# EAGLE design General IO (EAGLE 5.03)
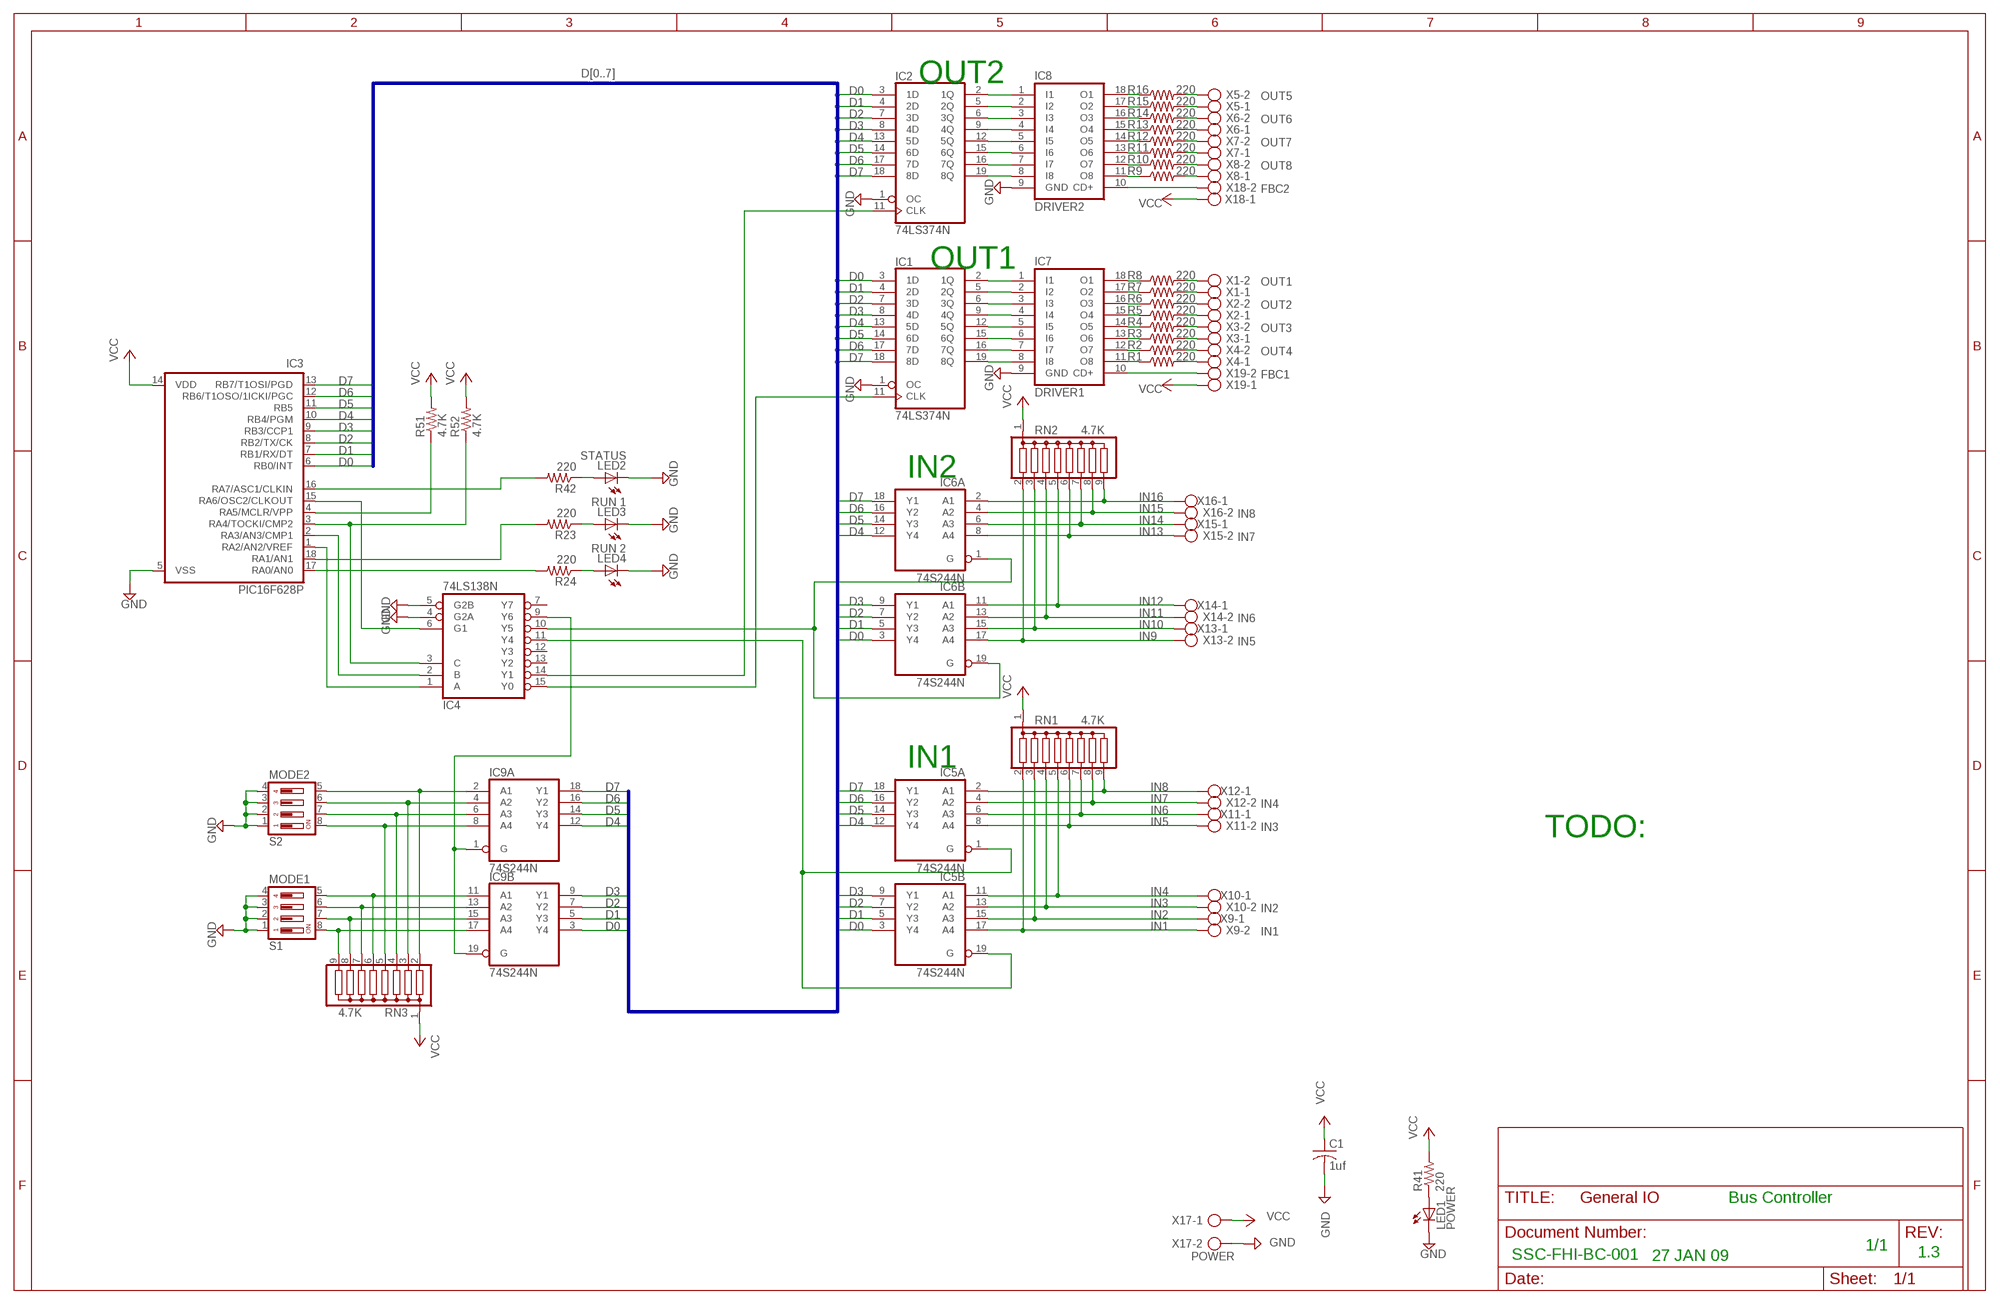
[diagram p0: schematic, sheet 1]

## Parts
C1  1uf  C-US025-025X050  [C025-025X050]
IC1  74LS374N  [DIL20]
IC2  74LS374N  [DIL20]
IC3  PIC16F628P  [DIL18]
IC4  74LS138N  [DIL16]
IC5  74S244N  [DIL20]
IC6  74S244N  [DIL20]
IC7  DRIVER1  ULN2803A  [DIL18]
IC8  DRIVER2  ULN2803A  [DIL18]
IC9  74S244N  [DIL20]
LED1  POWER  LED5MM  [LED5MM]
LED2  STATUS  LED5MM  [LED5MM]
LED3  RUN 1  LED5MM  [LED5MM]
LED4  RUN 2  LED5MM  [LED5MM]
R1  220  R-US_0207/2V  [0207/2V]
R2  220  R-US_0207/2V  [0207/2V]
R3  220  R-US_0207/2V  [0207/2V]
R4  220  R-US_0207/2V  [0207/2V]
R5  220  R-US_0207/2V  [0207/2V]
R6  220  R-US_0207/2V  [0207/2V]
R7  220  R-US_0207/2V  [0207/2V]
R8  220  R-US_0207/2V  [0207/2V]
R9  220  R-US_0207/2V  [0207/2V]
R10  220  R-US_0207/2V  [0207/2V]
R11  220  R-US_0207/2V  [0207/2V]
R12  220  R-US_0207/2V  [0207/2V]
R13  220  R-US_0207/2V  [0207/2V]
R14  220  R-US_0207/2V  [0207/2V]
R15  220  R-US_0207/2V  [0207/2V]
R16  220  R-US_0207/2V  [0207/2V]
R23  220  R-US_0207/2V  [0207/2V]
R24  220  R-US_0207/2V  [0207/2V]
R41  220  R-US_0207/2V  [0207/2V]
R42  220  R-US_0207/2V  [0207/2V]
R51  4.7K  R-US_0207/2V  [0207/2V]
R52  4.7K  R-US_0207/2V  [0207/2V]
RN1  4.7K  G08R  [SIL9]
RN2  4.7K  G08R  [SIL9]
RN3  4.7K  G08R  [SIL9]
S1  MODE1  DS04  [DS-04]
S2  MODE2  DS04  [DS-04]
X1  OUT1  AK550/2  [AK550/2]
X2  OUT2  AK550/2  [AK550/2]
X3  OUT3  AK550/2  [AK550/2]
X4  OUT4  AK550/2  [AK550/2]
X5  OUT5  AK550/2  [AK550/2]
X6  OUT6  AK550/2  [AK550/2]
X7  OUT7  AK550/2  [AK550/2]
X8  OUT8  AK550/2  [AK550/2]
X9  IN1  AK550/2  [AK550/2]
X10  IN2  AK550/2  [AK550/2]
X11  IN3  AK550/2  [AK550/2]
X12  IN4  AK550/2  [AK550/2]
X13  IN5  AK550/2  [AK550/2]
X14  IN6  AK550/2  [AK550/2]
X15  IN7  AK550/2  [AK550/2]
X16  IN8  AK550/2  [AK550/2]
X17  POWER  AK500/2  [AK500/2]
X18  FBC2  AK550/2  [AK550/2]
X19  FBC1  AK550/2  [AK550/2]

## Nets
A0: IC3.1(RA2/AN2/VREF) IC4.1(A)
A1: IC3.2(RA3/AN3/CMP1) IC4.2(B)
A2: IC3.3(RA4/TOCKI/CMP2) IC4.3(C) R52.1
ADDR_EN: IC3.15(RA6/OSC2/CLKOUT) IC4.6(G1)
D0: IC1.3(1D) IC2.3(1D) IC3.6(RB0/INT) IC5.3(B:Y4) IC6.3(B:Y4) IC9.3(B:Y4)
D1: IC1.4(2D) IC2.4(2D) IC3.7(RB1/RX/DT) IC5.5(B:Y3) IC6.5(B:Y3) IC9.5(B:Y3)
D2: IC1.7(3D) IC2.7(3D) IC3.8(RB2/TX/CK) IC5.7(B:Y2) IC6.7(B:Y2) IC9.7(B:Y2)
D3: IC1.8(4D) IC2.8(4D) IC3.9(RB3/CCP1) IC5.9(B:Y1) IC6.9(B:Y1) IC9.9(B:Y1)
D4: IC1.13(5D) IC2.13(5D) IC3.10(RB4/PGM) IC5.12(A:Y4) IC6.12(A:Y4) IC9.12(A:Y4)
D5: IC1.14(6D) IC2.14(6D) IC3.11(RB5) IC5.14(A:Y3) IC6.14(A:Y3) IC9.14(A:Y3)
D6: IC1.17(7D) IC2.17(7D) IC3.12(RB6/T1OSO/1ICKI/PGC) IC5.16(A:Y2) IC6.16(A:Y2) IC9.16(A:Y2)
D7: IC1.18(8D) IC2.18(8D) IC3.13(RB7/T1OSI/PGD) IC5.18(A:Y1) IC6.18(A:Y1) IC9.18(A:Y1)
FBC1: IC7.10(CD+) X19.2
FBC2: IC8.10(CD+) X18.2
GND: C1.2 IC1.1(OC) IC2.1(OC) IC3.5(VSS) IC4.4(G2A) IC4.5(G2B) IC7.9(GND) IC8.9(GND) LED1.K(C) LED2.K(C) LED3.K(C) LED4.K(C) S1.1 S1.2 S1.3 S1.4 S2.1 S2.2 S2.3 S2.4 X17.2
IN1: IC5.17(B:A4) RN1.2 X9.2
IN2: IC5.15(B:A3) RN1.3 X9.1
IN3: IC5.13(B:A2) RN1.4 X10.2
IN4: IC5.11(B:A1) RN1.5 X10.1
IN5: IC5.8(A:A4) RN1.6 X11.2
IN6: IC5.6(A:A3) RN1.7 X11.1
IN7: IC5.4(A:A2) RN1.8 X12.2
IN8: IC5.2(A:A1) RN1.9 X12.1
IN9: IC6.17(B:A4) RN2.2 X13.2
IN10: IC6.15(B:A3) RN2.3 X13.1
IN11: IC6.13(B:A2) RN2.4 X14.2
IN12: IC6.11(B:A1) RN2.5 X14.1
IN13: IC6.8(A:A4) RN2.6 X15.2
IN14: IC6.6(A:A3) RN2.7 X15.1
IN15: IC6.4(A:A2) RN2.8 X16.2
IN16: IC6.2(A:A1) RN2.9 X16.1
N$1: IC4.11(Y4) IC5.1(A:G) IC5.19(B:G)
N$2: IC3.4(RA5/MCLR/VPP) R51.1
N$4: IC7.12(O7) R2.1
N$5: IC2.11(CLK) IC4.14(Y1)
N$6: IC1.11(CLK) IC4.15(Y0)
N$10: IC9.2(A:A1) RN3.2 S2.5
N$11: IC9.4(A:A2) RN3.3 S2.6
N$12: IC7.18(O1) R8.1
N$13: IC7.17(O2) R7.1
N$14: IC7.16(O3) R6.1
N$15: IC7.15(O4) R5.1
N$16: IC9.6(A:A3) RN3.4 S2.7
N$17: IC8.12(O7) R10.1
N$18: IC4.10(Y5) IC6.1(A:G) IC6.19(B:G)
N$19: IC9.8(A:A4) RN3.5 S2.8
N$20: IC1.16(7Q) IC7.7(I7)
N$21: IC7.14(O5) R4.1
N$22: IC1.19(8Q) IC7.8(I8)
N$23: IC1.2(1Q) IC7.1(I1)
N$24: IC1.5(2Q) IC7.2(I2)
N$25: IC1.6(3Q) IC7.3(I3)
N$26: IC1.9(4Q) IC7.4(I4)
N$27: IC1.12(5Q) IC7.5(I5)
N$28: IC1.15(6Q) IC7.6(I6)
N$29: IC2.19(8Q) IC8.8(I8)
N$30: IC7.13(O6) R3.1
N$31: IC2.16(7Q) IC8.7(I7)
N$32: IC7.11(O8) R1.1
N$33: IC2.15(6Q) IC8.6(I6)
N$34: IC9.11(B:A1) RN3.6 S1.5
N$35: IC9.13(B:A2) RN3.7 S1.6
N$36: IC9.15(B:A3) RN3.8 S1.7
N$37: LED4.A R24.1
N$38: LED3.A R23.1
N$39: IC9.17(B:A4) RN3.9 S1.8
N$41: IC4.9(Y6) IC9.1(A:G) IC9.19(B:G)
N$55: IC2.2(1Q) IC8.1(I1)
N$56: IC2.5(2Q) IC8.2(I2)
N$57: IC2.6(3Q) IC8.3(I3)
N$58: IC2.9(4Q) IC8.4(I4)
N$59: IC2.12(5Q) IC8.5(I5)
N$61: IC8.18(O1) R16.1
N$62: IC8.17(O2) R15.1
N$63: IC8.16(O3) R14.1
N$64: IC8.15(O4) R13.1
N$65: IC8.14(O5) R12.1
N$66: IC8.13(O6) R11.1
N$68: IC8.11(O8) R9.1
N$71: LED1.A R41.1
N$106: LED2.A R42.1
OUT1: R8.2 X1.2
OUT2: R7.2 X1.1
OUT3: R6.2 X2.2
OUT4: R5.2 X2.1
OUT5: R4.2 X3.2
OUT6: R3.2 X3.1
OUT7: R2.2 X4.2
OUT8: R1.2 X4.1
OUT9: R16.2 X5.2
OUT10: R15.2 X5.1
OUT11: R14.2 X6.2
OUT12: R13.2 X6.1
OUT13: R12.2 X7.2
OUT14: R11.2 X7.1
OUT15: R10.2 X8.2
OUT16: R9.2 X8.1
RUN1: IC3.18(RA1/AN1) R23.2
RUN2: IC3.17(RA0/AN0) R24.2
STATUS: IC3.16(RA7/ASC1/CLKIN) R42.2
VCC: C1.1 IC3.14(VDD) R41.2 R51.2 R52.2 RN1.1 RN2.1 RN3.1 X17.1 X18.1 X19.1
Unconnected: IC4.7(Y7) IC4.12(Y3) IC4.13(Y2)

## Buses
D[0..7]

## Notes on the sheet
- OUT2
- OUT1
- IN2
- IN1
- TODO:
- Bus Controller
- 1/1
- SSC-FHI-BC-001 | 27 JAN 09 | 1.3

## Power pins joined to a net without a drawn wire
GND: IC1.10(GND) IC2.10(GND) IC4.8(GND) IC5.10(P:GND) IC6.10(P:GND) IC9.10(P:GND)
VCC: IC1.20(VCC) IC2.20(VCC) IC4.16(VCC) IC5.20(P:VCC) IC6.20(P:VCC) IC9.20(P:VCC)

## Library data of the parts
C1 = rcl:C-US: CAPACITOR, American symbol
IC1 IC2 = 74xx-us:74*374: Octal D type transparent LATCH, edge triggered
IC3 = microchip:PIC16*F62: FLASH-Based 8-Bit CMOS Microcontroller Source: http://ww1.microchip.com/downloads/en/DeviceDoc/40300C.pdf
IC4 = 74xx-eu:74*138: 3-line to 8-line DECODER/DEMULTIPLEXER
IC5 IC6 IC9 = 74xx-us:74*244: Octal BUFFER and LINE DRIVER, 3-state
IC7 IC8 = uln-udn:ULN2803A: DRIVER ARRAY
LED1-LED4 = led:LED: LED OSRAM: - CHIPLED LG R971, LG N971, LY N971, LG Q971, LY Q971, LO R971, LY R971 LH N974, LH R974 LS Q976, LO Q976, LY Q976 LO Q996 - Hyper CHIPLED LW Q18S LB Q993, LB Q99A, LB R99A - SideLED LS A670, LO A670, LY A670, LG A670, LP A670 LB A673, LV A673, LT A673, LW A673 LH A674 LY A675 LS A676, LA A676, LO A676, LY A676, LW A676 LS A679, LY A679, LG A679 - Hyper Micro SIDELED® LS Y876, LA Y876, LO Y876, LY Y876 LT Y87S - SmartLED LW L88C, LW L88S LB L89C, LB L89S, LG L890 LS L89K, LO L89K, LY L89K LS L896, LA L896, LO L896, LY L896 - TOPLED LS T670, LO T670, LY T670, LG T670, LP T670 LSG T670, LSP T670, LSY T670, LOP T670, LYG T670 LG T671, LOG T671, LSG T671 LB T673, LV T673, LT T673, LW T673 LH T674 LS T676, LA T676, LO T676, LY T676, LB T676, LH T676, LSB T676, LW T676 LB T67C, LV T67C, LT T67C, LS T67K, LO T67K, LY T67K, LW E67C LS E67B, LA E67B, LO E67B, LY E67B, LB E67C, LV E67C, LT E67C LW T67C LS T679, LY T679, LG T679 LS T770, LO T770, LY T770, LG T770, LP T770 LB T773, LV T773, LT T773, LW T773 LH T774 LS E675, LA E675, LY E675, LS T675 LS T776, LA T776, LO T776, LY T776, LB T776 LHGB T686 LT T68C, LB T68C - Hyper Mini TOPLED® LB M676 - Mini TOPLED Santana® LG M470 LS M47K, LO M47K, LY M47K Source: http://www.osram.convergy.de - LUMILED® LXK2-PW12-R00, LXK2-PW12-S00, LXK2-PW14-U00, LXK2-PW14-V00 LXK2-PM12-R00, LXK2-PM12-S00, LXK2-PM14-U00 LXK2-PE12-Q00, LXK2-PE12-R00, LXK2-PE12-S00, LXK2-PE14-T00, LXK2-PE14-U00 LXK2-PB12-K00, LXK2-PB12-L00, LXK2-PB12-M00, LXK2-PB14-N00, LXK2-PB14-P00, LXK2-PB14-Q00 LXK2-PR12-L00, LXK2-PR12-M00, LXK2-PR14-Q00, LXK2-PR14-R00 LXK2-PD12-Q00, LXK2-PD12-R00, LXK2-PD12-S00 LXK2-PH12-R00, LXK2-PH12-S00 LXK2-PL12-P00, LXK2-PL12-Q00, LXK2-PL12-R00 Source: www.luxeon.com
R1-R16 R23 R24 R41 R42 R51 R52 = resistor:R-US_: RESISTOR, American symbol
RN1-RN3 = resistor-sil:G08R: SIL RESISTOR
S1 S2 = switch-dil:DS04: DIL/CODE SWITCH
X1-X16 X18 X19 = con-ptr500+_v5:AK550/2: CONNECTOR
X17 = con-ptr500:AK500/2: CONNECTOR

## Board
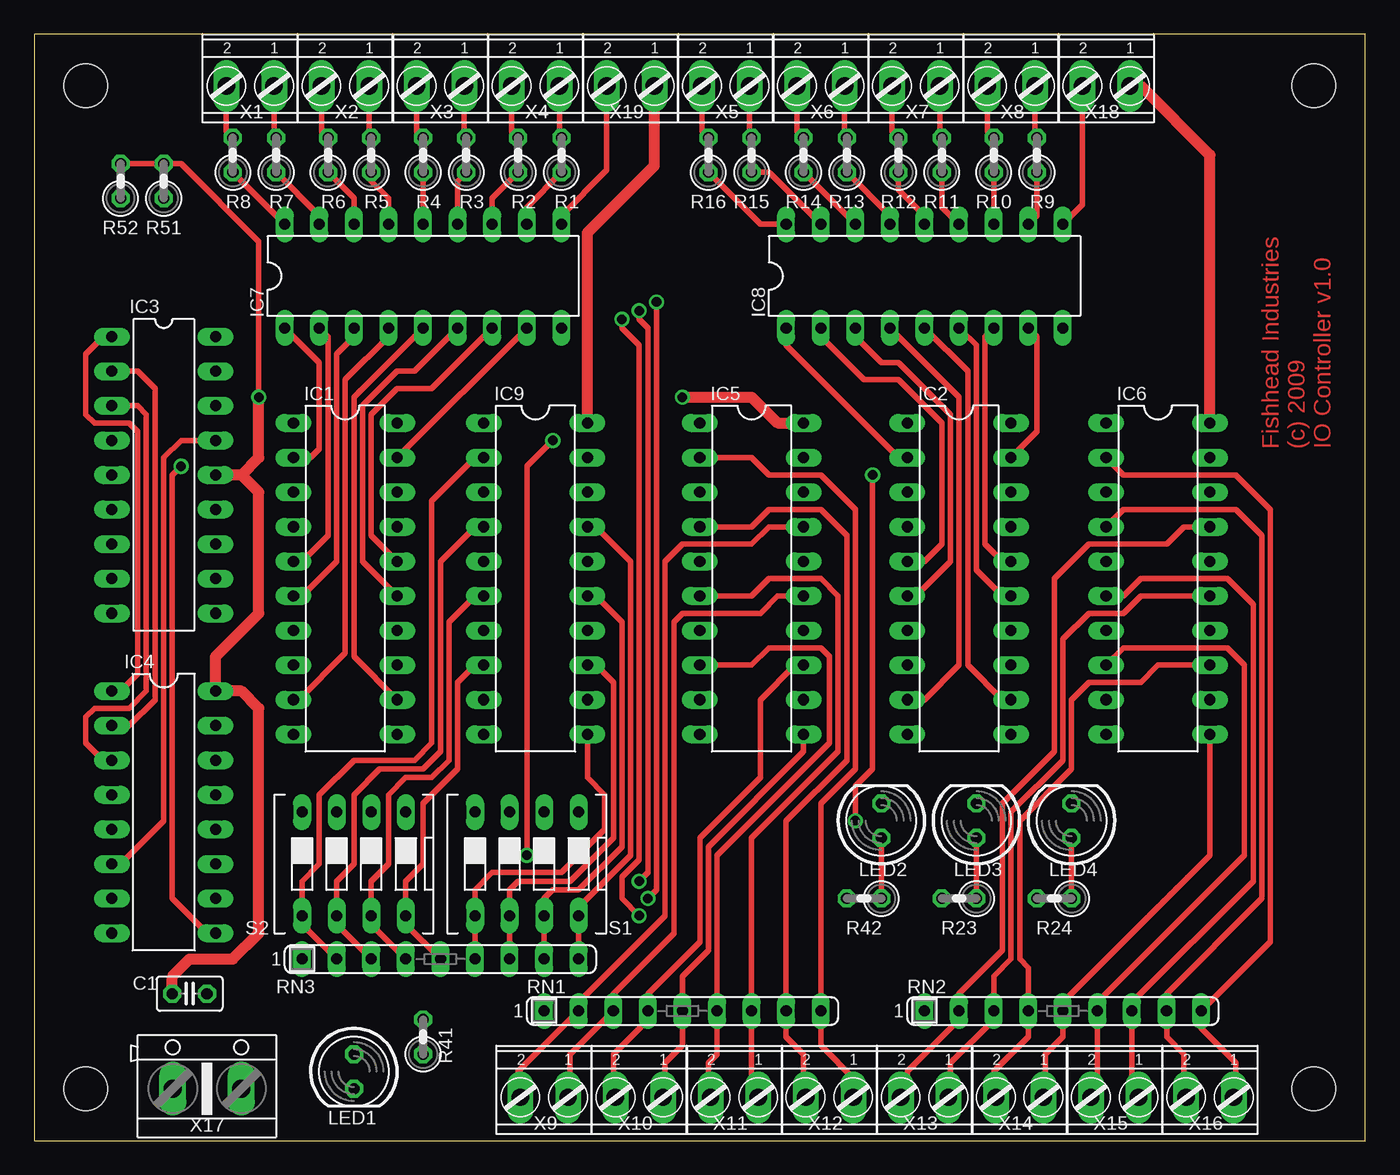
[diagram p1: board, top side]
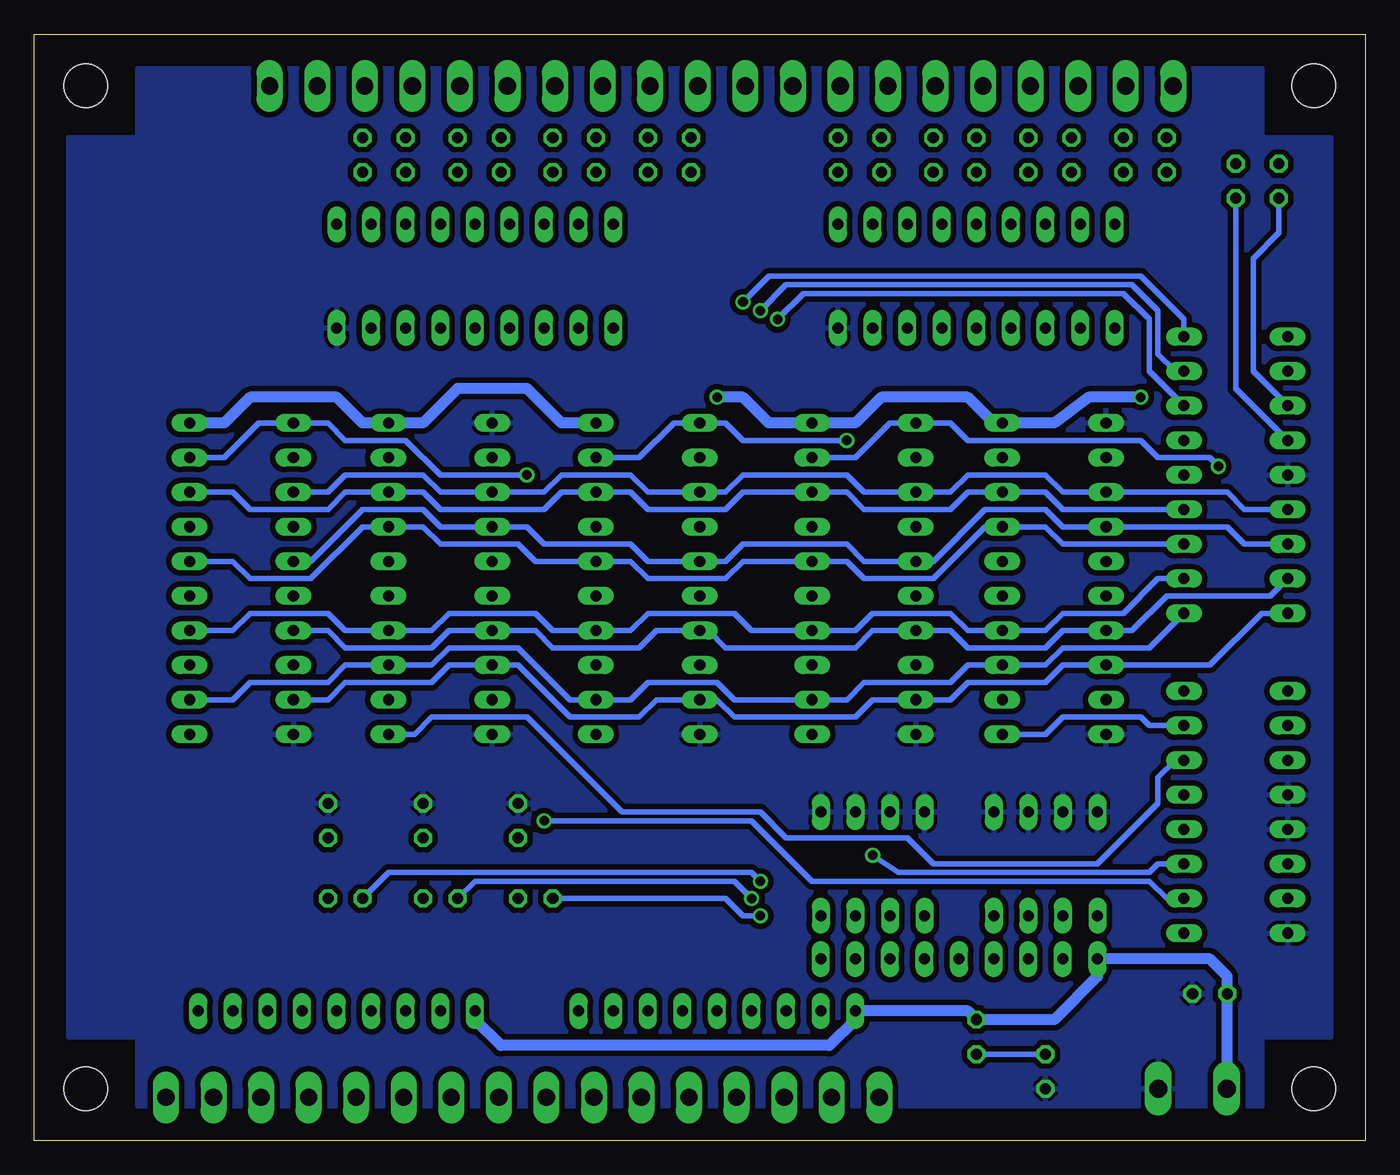
[diagram p2: board, bottom side, seen from below]

Size 97.79 x 81.28 mm. Coordinates in mm from the lower left corner, seen from the top.
Outline: 0,0 97.79,0 97.79,81.28 0,81.28 0,0
Copper layers (1*16): Top 0.035mm / dielectric 1.5mm / Bottom 0.035mm
Design rules "default *": minimum track width 10mil, minimum drill 24mil, track to track 16mil, track to pad 16mil, pad to pad 8mil, via to via 8mil, smd to smd 8mil, copper to edge 40mil, drill to drill 8mil, minimum pad ring 10mil, minimum via ring 8mil, stop-mask expansion 4mil, vias tented up to drill 0mil, thermal gap 10mil
Holes 3.2 mm at 3.81,77.47 93.98,77.47 93.98,3.81 3.81,3.81

### Footprints (pad centres in the part's own frame; a part is rotated, then mirrored left to right if it is on the bottom)
C025-025X050 = drill 0.813 octagon: 1 -1.27,0; 2 1.27,0
DIL20 = drill 0.813 long: 1 -11.43,-3.81; 2 -8.89,-3.81; 3 -6.35,-3.81; 4 -3.81,-3.81; 5 -1.27,-3.81; 6 1.27,-3.81; 7 3.81,-3.81; 8 6.35,-3.81; 9 8.89,-3.81; 10 11.43,-3.81; 11 11.43,3.81; 12 8.89,3.81; 13 6.35,3.81; 14 3.81,3.81; 15 1.27,3.81; 16 -1.27,3.81; 17 -3.81,3.81; 18 -6.35,3.81; 19 -8.89,3.81; 20 -11.43,3.81
DIL18 = drill 0.813 long: 1 -10.16,-3.81; 2 -7.62,-3.81; 3 -5.08,-3.81; 4 -2.54,-3.81; 5 0,-3.81; 6 2.54,-3.81; 7 5.08,-3.81; 8 7.62,-3.81; 9 10.16,-3.81; 10 10.16,3.81; 11 7.62,3.81; 12 5.08,3.81; 13 2.54,3.81; 14 0,3.81; 15 -2.54,3.81; 16 -5.08,3.81; 17 -7.62,3.81; 18 -10.16,3.81
DIL16 = drill 0.813 long: 1 -8.89,-3.81; 2 -6.35,-3.81; 3 -3.81,-3.81; 4 -1.27,-3.81; 5 1.27,-3.81; 6 3.81,-3.81; 7 6.35,-3.81; 8 8.89,-3.81; 9 8.89,3.81; 10 6.35,3.81; 11 3.81,3.81; 12 1.27,3.81; 13 -1.27,3.81; 14 -3.81,3.81; 15 -6.35,3.81; 16 -8.89,3.81
LED5MM = drill 0.813 octagon: A -1.27,0; K 1.27,0
0207/2V = drill 0.813 octagon: 1 -1.27,0; 2 1.27,0
SIL9 = drill 0.813 long: 1 -10.16,0; 2 -7.62,0; 3 -5.08,0; 4 -2.54,0; 5 0,0; 6 2.54,0; 7 5.08,0; 8 7.62,0; 9 10.16,0
DS-04 = drill 0.813 long: 1 -3.81,-3.81; 2 -1.27,-3.81; 3 1.27,-3.81; 4 3.81,-3.81; 5 3.81,3.81; 6 1.27,3.81; 7 -1.27,3.81; 8 -3.81,3.81
AK550/2 = drill 1.27 long: 1 -1.75,0; 2 1.75,0
AK500/2 = drill 1.321 long: 1 -2.515,0; 2 2.515,0

### Placement (x,y rotation side)
C1  11.43,10.79 0 top
IC1  22.86,41.27 270 top
IC2  67.94,41.27 270 top
IC3  9.53,48.9 270 top
IC4  9.53,24.13 270 top
IC5  52.7,41.27 270 top
IC6  82.55,41.27 270 top
IC7  28.57,63.5 0 top
IC8  65.41,63.5 0 top
IC9  36.83,41.27 270 top
LED1  23.5,5.08 270 top
LED2  62.23,23.5 90 top
LED3  69.22,23.5 90 top
LED4  76.2,23.5 90 top
R1  38.73,72.39 90 top
R2  35.56,72.39 90 top
R3  31.75,72.39 90 top
R4  28.57,72.39 90 top
R5  24.77,72.39 90 top
R6  21.59,72.39 90 top
R7  17.78,72.39 90 top
R8  14.61,72.39 90 top
R9  73.66,72.39 90 top
R10  70.48,72.39 90 top
R11  66.67,72.39 90 top
R12  63.5,72.39 90 top
R13  59.69,72.39 90 top
R14  56.52,72.39 90 top
R15  52.7,72.39 90 top
R16  49.53,72.39 90 top
R23  67.94,17.78 180 top
R24  74.93,17.78 180 top
R41  28.57,7.62 90 top
R42  60.96,17.78 180 top
R51  9.53,70.48 90 top
R52  6.35,70.48 90 top
RN1  47.62,9.53 0 top
RN2  75.56,9.53 0 top
RN3  29.84,13.34 0 top
S1  36.2,20.32 180 top
S2  23.5,20.32 180 top
X1  15.88,77.47 180 top
X2  22.86,77.47 180 top
X3  29.84,77.47 180 top
X4  36.83,77.47 180 top
X5  50.8,77.47 180 top
X6  57.78,77.47 180 top
X7  64.77,77.47 180 top
X8  71.75,77.47 180 top
X9  37.47,3.17 180 top
X10  44.45,3.17 180 top
X11  51.44,3.17 180 top
X12  58.42,3.17 180 top
X13  65.41,3.17 180 top
X14  72.39,3.17 180 top
X15  79.38,3.17 180 top
X16  86.36,3.17 180 top
X17  12.7,3.81 0 top
X18  78.74,77.47 180 top
X19  43.81,77.47 180 top

### Tracks (layer width: path | path; a pad name or v marks a point on that pad's centre or on a via)
A0
  Top 0.406: IC3.1 5.08,59.05 3.81,57.78 3.81,53.34 4.45,52.7 6.99,52.7 7.62,52.07 7.62,34.29 6.35,33.02 IC4.1
A1
  Top 0.406: IC4.2 6.99,30.48 8.89,32.38 8.89,55.24 7.62,56.52 IC3.2
A2
  Top 0.406: IC4.3 5.08,27.94 3.81,29.21 3.81,31.11 4.45,31.75 6.99,31.75 8.26,33.02 8.26,53.34 7.62,53.98 IC3.3
  Bottom 0.406: R52.1 6.35,66.67 8.26,64.77 8.26,56.52 IC3.3
ADDR_EN
  Top 0.406: IC4.6 6.35,20.32 9.53,23.5 9.53,50.16 10.79,51.44 IC3.15
D0
  Bottom 0.406: IC3.6 8.89,46.35 10.16,47.62 IC1.3 22.23,47.62 23.5,48.9 29.21,48.9 30.48,47.62 IC9.3 36.83,47.62 38.1,48.9 45.72,48.9 46.99,47.62 IC5.3 52.7,47.62 53.98,48.9 59.05,48.9 60.33,47.62 IC2.3 67.94,47.62 69.22,48.9 74.93,48.9 76.2,47.62 IC6.3
D1
  Bottom 0.406: IC3.7 8.89,43.81 10.16,45.09 IC1.4 22.23,45.09 23.5,46.35 27.94,46.35 31.75,42.55 IC9.5 36.83,42.55 38.1,43.81 45.72,43.81 46.99,42.55 IC5.5 52.7,42.55 53.98,43.81 60.33,43.81 61.59,45.09 IC2.4 67.94,45.09 69.22,46.35 73.66,46.35 77.47,42.55 IC6.5
D2
  Bottom 0.406: IC3.8 6.99,40.01 14.61,40.01 17.14,37.47 IC1.7 22.23,37.47 23.5,36.2 29.21,36.2 30.48,37.47 IC9.7 36.2,37.47 37.47,36.2 46.99,36.2 48.26,37.47 IC5.7 52.07,37.47 53.34,36.2 59.69,36.2 60.96,37.47 IC2.7 67.31,37.47 68.58,36.2 74.93,36.2 76.2,37.47 IC6.7
D3
  Bottom 0.406: IC6.9 76.2,32.38 74.93,33.66 68.58,33.66 67.31,34.92 IC2.8 62.23,34.92 58.42,31.11 53.34,31.11 52.07,32.38 IC5.9 47.62,32.38 46.35,31.11 37.47,31.11 36.2,32.38 IC9.9 30.48,32.38 29.21,33.66 23.5,33.66 22.23,34.92 IC1.8 11.43,34.92 7.62,38.73 IC3.9
D4
  Bottom 0.406: IC3.10 15.88,36.2 22.23,36.2 23.5,34.92 IC1.13 29.21,34.92 30.48,33.66 36.83,33.66 38.1,32.38 IC9.12 46.35,32.38 47.62,33.66 52.7,33.66 53.98,32.38 IC5.12 58.42,32.38 62.23,36.2 67.31,36.2 68.58,34.92 IC2.13 74.93,34.92 76.2,33.66 81.92,33.66 83.19,32.38 IC6.12
D5
  Bottom 0.406: IC3.11 15.24,41.27 17.78,38.73 22.23,38.73 23.5,37.47 IC1.14 29.21,37.47 30.48,38.73 36.2,38.73 37.47,37.47 IC9.14 45.09,37.47 46.35,38.73 52.7,38.73 53.98,37.47 IC5.14 59.69,37.47 60.96,38.73 67.31,38.73 68.58,37.47 IC2.14 74.93,37.47 76.2,38.73 81.92,38.73 83.19,37.47 IC6.14
D6
  Bottom 0.406: IC3.12 22.23,43.81 23.5,45.09 IC1.17 27.94,45.09 31.75,41.27 36.83,41.27 38.1,42.55 IC9.16 45.72,42.55 46.99,41.27 52.7,41.27 53.98,42.55 IC5.16 60.96,42.55 62.23,43.81 67.94,43.81 69.22,45.09 IC2.17 73.66,45.09 77.47,41.27 81.92,41.27 83.19,42.55 IC6.16
D7
  Bottom 0.406: IC3.13 22.23,46.35 23.5,47.62 IC1.18 29.21,47.62 30.48,46.35 36.83,46.35 38.1,47.62 IC9.18 45.72,47.62 46.99,46.35 52.7,46.35 53.98,47.62 IC5.18 59.05,47.62 60.33,46.35 67.94,46.35 69.22,47.62 71.12,47.62 | 71.12,47.62 IC2.18 | IC6.18 83.19,47.62 81.92,46.35 76.2,46.35 74.93,47.62 71.12,47.62
FBC1
  Top 0.406: X19.2 42.06,71.28 38.73,67.94 IC7.10
FBC2
  Top 0.406: X18.2 76.99,68.73 IC8.10
GND
  pour Bottom: 2.54,73.66 7.62,73.66 7.62,78.74 90.17,78.74 90.17,73.66 95.25,73.66 95.25,7.62 90.17,7.62 90.17,2.54 7.62,2.54 7.62,7.62 2.54,7.62
IN1
  Top 0.406: IC5.17 53.98,45.09 52.7,43.81 47.62,43.81 46.35,42.55 46.35,16.51 40.01,10.16 RN1.2 35.56,5.08 35.56,3.33 X9.2
IN2
  Top 0.406: IC5.15 54.61,40.01 53.34,38.73 47.62,38.73 46.99,38.1 46.99,15.24 42.55,10.79 RN1.3 39.37,6.35 39.37,3.33 X9.1
IN3
  Top 0.406: IC5.13 55.88,34.92 53.34,32.38 53.34,26.67 48.9,22.23 48.9,14.61 45.09,10.79 RN1.4 45.09,8.89 42.55,6.35 42.55,3.33 X10.2
IN4
  Top 0.406: IC5.11 56.52,28.57 49.53,21.59 49.53,13.97 47.62,12.06 RN1.5 47.62,6.99 46.35,5.71 46.35,3.33 X10.1
IN5
  Top 0.406: IC5.8 52.7,34.92 53.98,36.2 57.78,36.2 58.42,35.56 58.42,29.21 50.16,20.95 RN1.6 50.16,6.35 49.53,5.71 49.53,3.33 X11.2
IN6
  Top 0.406: IC5.6 52.7,40.01 53.98,41.27 57.78,41.27 59.05,40.01 59.05,28.57 52.7,22.23 RN1.7 52.7,3.65 X11.1
IN7
  Top 0.406: IC5.4 52.7,45.09 53.98,46.35 57.78,46.35 59.69,44.45 59.69,27.94 55.24,23.5 RN1.8 55.24,7.62 56.52,6.35 56.52,3.33 X12.2
IN8
  Top 0.406: IC5.2 52.7,50.16 53.98,48.9 57.78,48.9 60.33,46.35 60.33,27.3 57.78,24.77 RN1.9 57.78,6.99 60.33,4.45 60.33,3.33 X12.1
IN9
  Top 0.406: IC6.17 84.45,45.09 83.19,43.81 77.47,43.81 74.93,41.27 74.93,28.57 71.12,24.77 71.12,13.97 67.94,10.79 RN2.2 67.94,8.89 64.14,5.08 64.14,3.65 X13.2
IN10
  Top 0.406: IC6.15 81.28,40.01 80.01,38.73 77.47,38.73 75.56,36.83 75.56,27.94 71.75,24.13 71.75,13.34 70.48,12.06 RN2.3 70.48,8.89 67.31,5.71 67.31,3.33 X13.1
IN11
  Top 0.406: IC6.13 82.55,34.92 81.28,33.66 77.47,33.66 76.2,32.38 76.2,27.3 72.39,23.5 72.39,13.34 73.03,12.7 RN2.4 73.03,7.62 70.48,5.08 70.48,3.33 X14.2
IN12
  Top 0.406: IC6.11 86.36,20.95 75.56,10.16 RN2.5 75.56,7.62 74.3,6.35 74.3,3.33 X14.1
IN13
  Top 0.406: IC6.8 80.01,36.2 87.63,36.2 88.9,34.92 88.9,20.95 78.11,10.16 RN2.6 78.11,3.65 X15.2
IN14
  Top 0.406: IC6.6 80.01,40.01 81.28,41.27 87.63,41.27 89.53,39.37 89.53,19.05 80.64,10.16 RN2.7 80.64,3.65 X15.1
IN15
  Top 0.406: IC6.4 80.01,46.35 88.27,46.35 90.17,44.45 90.17,17.78 83.19,10.79 RN2.8 83.19,7.62 84.45,6.35 84.45,3.33 X16.2
IN16
  Top 0.406: IC6.2 80.01,48.9 88.27,48.9 90.81,46.35 90.81,14.61 RN2.9 85.72,8.26 88.27,5.71 88.27,3.33 X16.1
N$1  (via drill 0.7)
  Top 0.406: v36.2,20.95 36.2,49.53 v38.1,51.44
  Bottom 0.406: IC5.19 53.34,50.16 50.8,52.7 IC5.1 46.99,52.7 45.72,51.44 v38.1,51.44 | IC4.11 15.24,20.32 15.88,19.68 34.29,19.68 v36.2,20.95
N$2
  Bottom 0.406: R51.1 9.53,55.24 IC3.4
N$4
  Top 0.406: R2.1 33.66,69.22 IC7.12
N$5
  Bottom 0.406: IC4.14 13.97,27.94 15.24,26.67 15.24,24.77 19.68,20.32 31.75,20.32 33.66,22.23 42.55,22.23 44.45,24.13 54.61,24.13 61.59,31.11 68.58,31.11 69.85,29.84 IC2.11
N$6
  Bottom 0.406: IC4.15 15.88,30.48 16.51,31.11 22.23,31.11 23.5,29.84 IC1.11
N$10
  Top 0.406: IC9.2 32.38,50.16 29.21,46.99 29.21,29.21 27.94,27.94 23.5,27.94 20.95,25.4 20.95,20.32 19.68,19.05 S2.5 19.68,15.88 RN3.2
N$11
  Top 0.406: IC9.4 32.38,45.09 29.84,42.55 29.84,28.57 28.57,27.3 25.4,27.3 23.5,25.4 23.5,20.32 22.23,19.05 S2.6 22.23,15.88 RN3.3
N$12
  Top 0.406: R8.1 IC7.18
N$13
  Top 0.406: R7.1 20.95,67.94 IC7.17
N$14
  Top 0.406: R6.1 23.5,69.22 IC7.16
N$15
  Top 0.406: R5.1 24.77,70.48 26.04,69.22 IC7.15
N$16
  Top 0.406: IC9.6 32.38,40.01 30.48,38.1 30.48,27.94 29.21,26.67 27.3,26.67 26.04,25.4 26.04,20.32 24.77,19.05 S2.7 24.77,15.88 RN3.4
N$17
  Top 0.406: IC8.12 R10.1
N$18  (via drill 0.7)
  Top 0.406: v60.33,23.5 60.33,26.04 61.59,27.3 v61.59,48.9
  Bottom 0.406: IC6.19 83.82,50.16 81.28,52.7 IC6.1 76.2,52.7 74.93,51.44 70.48,51.44 67.94,48.9 v61.59,48.9 | IC4.10 14.61,17.78 15.88,19.05 40.64,19.05 45.09,23.5 v60.33,23.5
N$19
  Top 0.406: IC9.8 32.38,34.92 31.11,33.66 31.11,27.3 28.57,24.77 28.57,20.32 27.3,19.05 S2.8 27.3,15.88 RN3.5
N$20
  Top 0.406: IC1.16 24.77,44.45 24.77,53.34 26.67,55.24 29.21,55.24 IC7.7
N$21
  Top 0.406: IC7.14 R4.1
N$22
  Top 0.406: IC1.19 IC7.8
N$23
  Top 0.406: IC1.2 20.32,50.16 20.95,50.8 20.95,57.15 IC7.1
N$24
  Top 0.406: IC7.2 21.59,59.05 21.59,44.45 19.68,42.55 IC1.5
N$25
  Top 0.406: IC7.3 23.5,59.05 22.23,57.78 22.23,42.55 19.68,40.01 IC1.6
N$26
  Top 0.406: IC1.9 19.44,32.38 22.86,35.8 22.86,55.88 26.04,59.05 IC7.4
N$27
  Top 0.406: IC1.12 23.5,35.56 23.5,54.61 IC7.5
N$28
  Top 0.406: IC1.15 24.13,42.55 24.13,53.98 26.67,56.52 27.94,56.52 IC7.6
N$29
  Top 0.406: IC2.19 73.66,52.07 73.66,59.05 IC8.8
N$30
  Top 0.406: R3.1 31.11,70.48 IC7.13
N$31
  Top 0.406: IC2.16 71.12,42.55 69.85,43.81 69.85,59.05 IC8.7
N$32
  Top 0.406: R1.1 36.2,68.58 IC7.11
N$33
  Top 0.406: IC2.15 71.12,40.01 69.22,41.91 69.22,58.42 IC8.6
N$34
  Top 0.406: RN3.6 S1.5 32.38,18.41 33.66,19.68 38.73,19.68 41.91,22.86 41.91,25.4 40.64,26.67 IC9.11
N$35
  Top 0.406: IC9.13 41.27,34.92 42.55,33.66 42.55,22.23 39.37,19.05 35.56,19.05 34.92,18.41 S1.6 RN3.7
N$36
  Top 0.406: IC9.15 41.27,40.01 43.18,38.1 43.18,21.59 40.01,18.41 38.1,18.41 37.47,17.78 S1.7 RN3.8
N$37
  Top 0.406: R24.1 LED4.A
N$38
  Top 0.406: R23.1 LED3.A
N$39
  Top 0.406: IC9.17 41.27,45.09 43.81,42.55 43.81,20.95 40.01,17.14 S1.8 RN3.9
N$41  (via drill 0.7)
  Top 0.406: IC4.9 12.7,15.24 10.16,17.78 10.16,48.9 v10.79,49.53
  Bottom 0.406: IC9.19 37.47,50.16 34.92,52.7 IC9.1 30.48,52.7 29.21,51.44 16.51,51.44 15.24,50.16 11.43,50.16 v10.79,49.53
N$55
  Top 0.406: IC2.2 63.5,50.16 55.24,58.42 IC8.1
N$56
  Top 0.406: IC2.5 65.41,42.55 66.67,43.81 66.67,52.7 63.5,55.88 60.96,55.88 57.78,59.05 IC8.2
N$57
  Top 0.406: IC2.6 64.77,40.01 67.31,42.55 67.31,53.34 63.5,57.15 62.23,57.15 60.33,59.05 IC8.3
N$58
  Top 0.406: IC2.9 65.41,32.38 67.94,34.92 67.94,54.61 IC8.4
N$59
  Top 0.406: IC2.12 71.12,32.38 68.58,34.92 68.58,56.52 IC8.5
N$61
  Top 0.406: R16.1 53.34,67.31 IC8.18
N$62
  Top 0.406: R15.1 53.98,71.12 IC8.17
N$63
  Top 0.406: IC8.16 R14.1
N$64
  Top 0.406: R13.1 62.87,67.94 IC8.15
N$65
  Top 0.406: R12.1 63.5,69.85 65.41,67.94 IC8.14
N$66
  Top 0.406: R11.1 66.67,68.58 IC8.13
N$68
  Top 0.406: R9.1 73.66,67.94 IC8.11
N$71
  Bottom 0.406: LED1.A R41.1
N$106
  Top 0.406: R42.1 LED2.A
OUT1
  Top 0.406: X1.2 14.12,74.14 R8.2
OUT2
  Top 0.406: X1.1 17.62,73.81 R7.2
OUT3
  Top 0.406: X2.2 21.11,74.14 R6.2
OUT4
  Top 0.406: X2.1 24.61,73.81 R5.2
OUT5
  Top 0.406: X3.2 28.09,74.14 R4.2
OUT6
  Top 0.406: X3.1 31.59,73.81 R3.2
OUT7
  Top 0.406: X4.2 35.08,74.14 R2.2
OUT8
  Top 0.406: X4.1 38.58,73.81 R1.2
OUT9
  Top 0.406: X5.2 49.05,74.14 R16.2
OUT10
  Top 0.406: X5.1 52.55,73.81 R15.2
OUT11
  Top 0.406: X6.2 56.03,74.14 R14.2
OUT12
  Top 0.406: X6.1 59.53,73.81 R13.2
OUT13
  Top 0.406: X7.2 63.02,74.14 R12.2
OUT14
  Top 0.406: X7.1 66.52,73.81 R11.2
OUT15
  Top 0.406: X8.2 70,74.14 R10.2
OUT16
  Top 0.406: X8.1 73.5,73.81 R9.2
RUN1  (via drill 0.7)
  Top 0.406: v45.72,61.59 45.72,18.41 v45.09,17.78
  Bottom 0.406: IC3.18 13.34,60.33 16.51,63.5 43.81,63.5 v45.72,61.59 | R23.2 65.41,19.05 46.35,19.05 v45.09,17.78
RUN2  (via drill 0.7)
  Top 0.406: v44.45,60.96 44.45,60.33 45.09,59.69 45.09,19.68 v44.45,19.05
  Bottom 0.406: IC3.17 13.97,56.52 15.24,57.78 15.24,60.96 17.14,62.87 42.55,62.87 v44.45,60.96 | R24.2 71.75,19.68 45.09,19.68 v44.45,19.05
STATUS  (via drill 0.7)
  Top 0.406: v43.18,60.33 43.18,59.69 44.45,58.42 44.45,20.64 43.18,19.37 43.18,17.78 v44.45,16.51
  Bottom 0.406: IC3.16 15.88,56.52 15.88,60.33 17.78,62.23 41.27,62.23 v43.18,60.33 | v44.45,16.51 45.72,16.51 46.99,17.78 R42.2
VCC  (via drill 0.7)
  Top 0.406: R52.2 R51.2 10.79,71.75 16.51,66.04 v16.51,54.61
  Top 0.813: X17.1 10.16,3.83 | 15.24,48.9 16.51,47.62 16.51,38.73 13.34,35.56 IC4.16 15.24,33.02 16.51,31.75 16.51,15.24 14.61,13.34 11.43,13.34 10.16,12.06 C1.1 | 15.24,48.9 IC3.14 | 15.24,48.9 16.51,50.16 v16.51,54.61 | IC6.20 86.36,72.39 81.28,77.47 X18.1 | X19.1 45.56,71.6 40.64,66.67 IC9.20 | v47.62,54.61 52.7,54.61 54.61,52.7 IC5.20
  Bottom 0.813: IC6.20 83.82,52.7 81.92,54.61 75.56,54.61 73.66,52.7 IC2.20 69.22,52.7 66.67,55.24 61.59,55.24 59.05,52.7 IC5.20 | v16.51,54.61 20.32,54.61 22.86,52.7 IC1.20 27.3,52.7 29.21,54.61 35.56,54.61 37.47,52.7 IC9.20 43.81,52.7 45.72,54.61 v47.62,54.61 | X17.1 10.16,3.83 C1.1 10.16,12.06 11.43,13.34 RN3.1 19.68,12.06 22.86,8.89 R41.2 29.21,9.53 RN1.1 37.47,8.89 39.37,6.99 63.5,6.99 65.41,8.89 RN2.1

### Text on the board
Top: Fishhead Industries | (c) 2009 | IO Controller v1.0